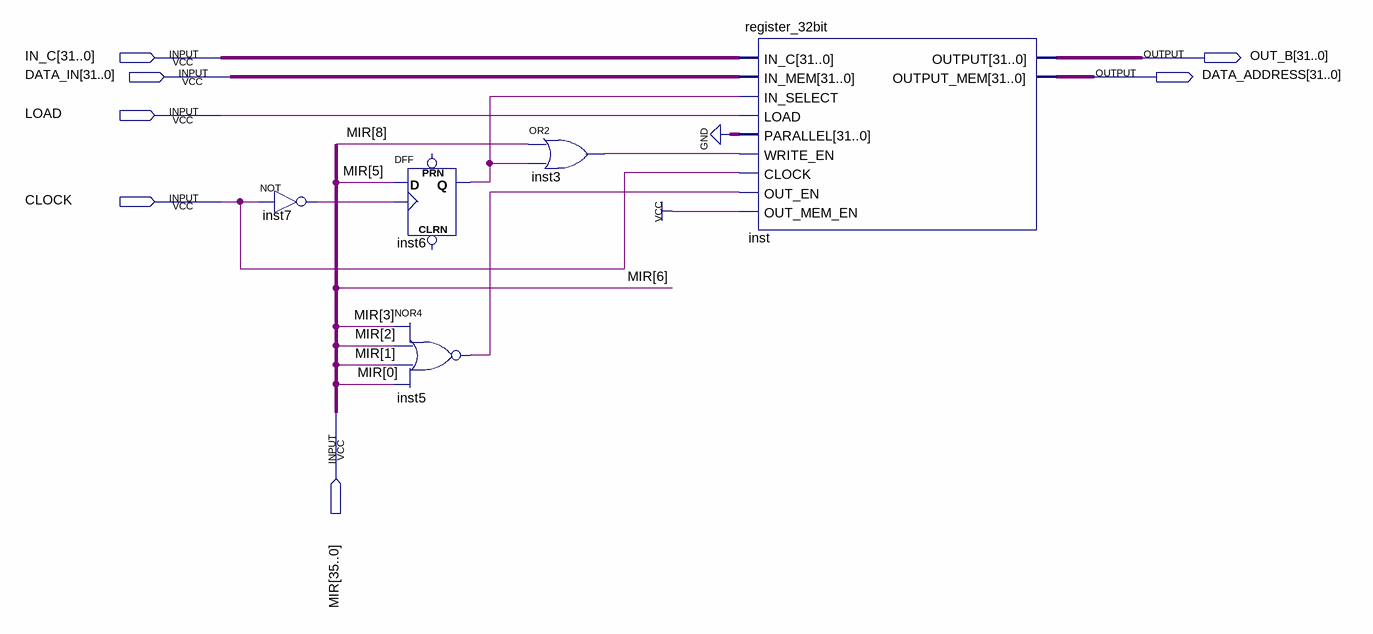
[diagram p0: schematic sheet]
// Quartus schematic MDR.bdf as structural Verilog: 5 symbols, 7 pins
module MDR (
  input  [31:0] IN_C,
  input  [31:0] DATA_IN,
  input  LOAD,
  input  CLOCK,
  input  [35:0] MIR,
  output [31:0] OUT_B,
  output [31:0] DATA_ADDRESS
);

  wire inst3_out, inst5_out, inst6_q, inst7_out;

  not inst7 (inst7_out, CLOCK);
  DFF inst6 (.CLK(inst7_out), .D(MIR[5]), .Q(inst6_q));  // open: CLRN, PRN
  nor inst5 (inst5_out, MIR[3], MIR[2], MIR[1], MIR[0]);
  or inst3 (inst3_out, MIR[8], inst6_q);
  register_32bit inst (
    .IN_C(IN_C), .IN_MEM(DATA_IN), .IN_SELECT(inst6_q), .LOAD(LOAD), .PARALLEL({32{1'b0}}),
    .WRITE_EN(inst3_out), .CLOCK(CLOCK), .OUT_EN(inst5_out), .OUT_MEM_EN(1'b1), .OUTPUT(OUT_B),
    .OUTPUT_MEM(DATA_ADDRESS));
endmodule
